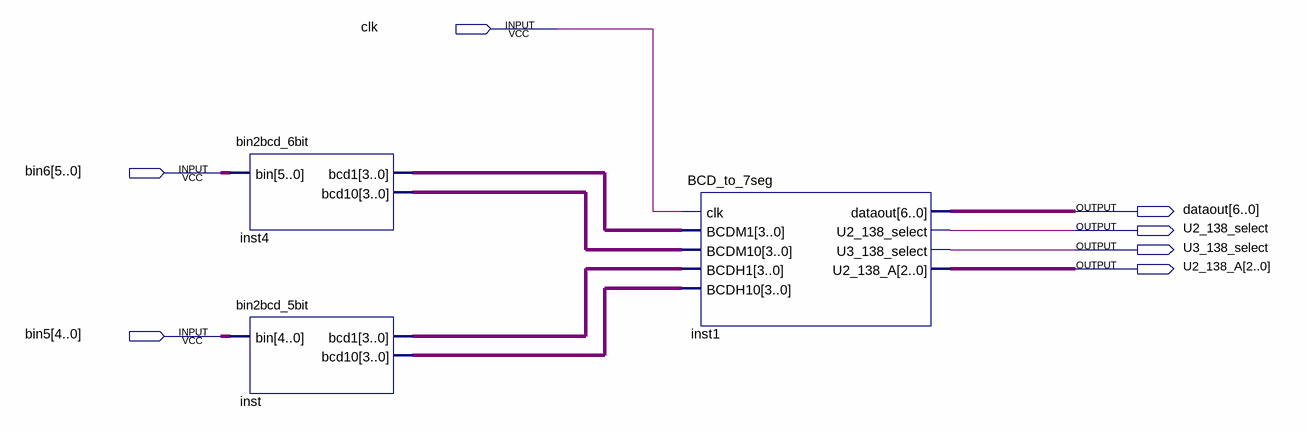
[diagram p0: schematic sheet]
// Quartus schematic out_to_7seg.bdf as structural Verilog: 3 symbols, 7 pins
module out_to_7seg (
  input  clk,
  input  [5:0] bin6,
  input  [4:0] bin5,
  output [6:0] dataout,
  output U2_138_select,
  output U3_138_select,
  output [2:0] U2_138_A
);

  wire [3:0] inst4_bcd1, inst4_bcd10, inst_bcd1, inst_bcd10;

  bin2bcd_6bit inst4 (.bin(bin6), .bcd1(inst4_bcd1), .bcd10(inst4_bcd10));
  bin2bcd_5bit inst (.bin(bin5), .bcd1(inst_bcd1), .bcd10(inst_bcd10));
  BCD_to_7seg inst1 (
    .clk(clk), .BCDM1(inst4_bcd1), .BCDM10(inst4_bcd10), .BCDH1(inst_bcd1), .BCDH10(inst_bcd10),
    .dataout(dataout), .U2_138_select(U2_138_select), .U3_138_select(U3_138_select), .U2_138_A(U2_138_A));
endmodule
